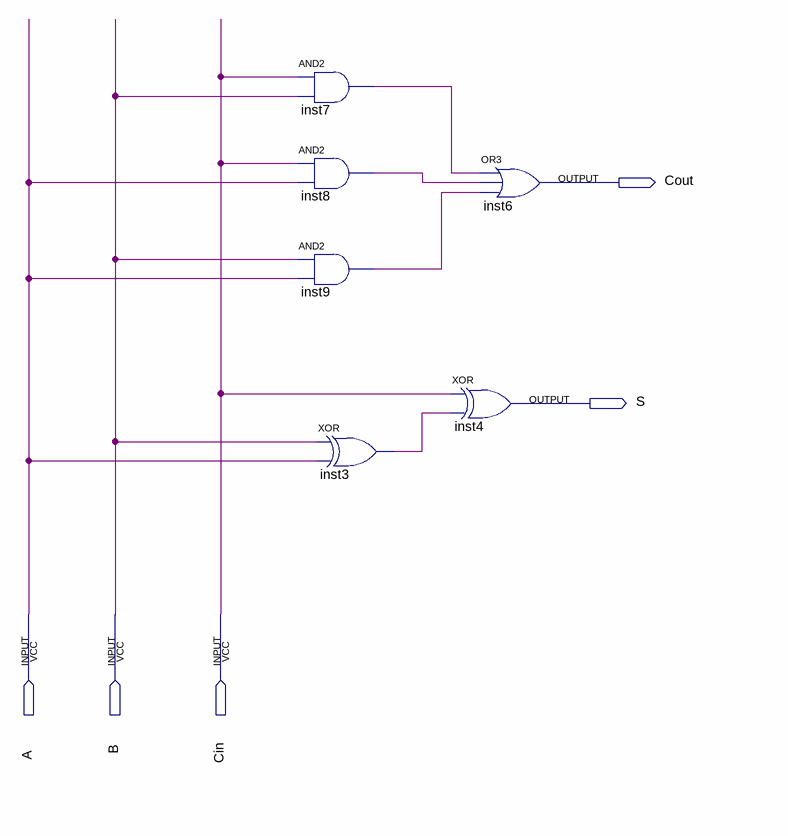
[diagram p0: schematic sheet]
// Quartus schematic somador1bit.bdf as structural Verilog: 6 symbols, 5 pins
module somador1bit (
  input  A,
  input  B,
  input  Cin,
  output Cout,
  output S
);

  wire inst3_out, inst7_out, inst8_out, inst9_out;

  and inst7 (inst7_out, Cin, B);
  and inst8 (inst8_out, Cin, A);
  and inst9 (inst9_out, B, A);
  xor inst3 (inst3_out, B, A);
  or inst6 (Cout, inst7_out, inst8_out, inst9_out);
  xor inst4 (S, Cin, inst3_out);
endmodule
